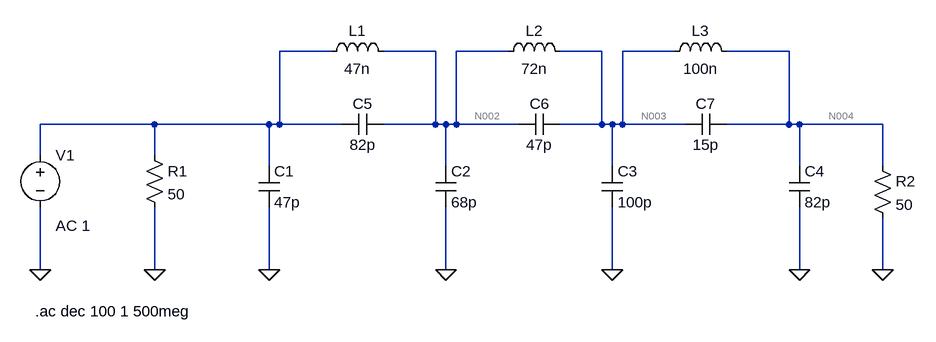
[diagram p0: schematic lpf_keyi-voltage_source.asc]
lpf_keyi-voltage_source.asc, the LTspice schematic file:
Version 4.1
SHEET 1 1396 680
WIRE 480 -16 400 -16
WIRE 640 -16 560 -16
WIRE 752 -16 672 -16
WIRE 896 -16 832 -16
WIRE 1008 -16 928 -16
WIRE 1184 -16 1088 -16
WIRE 208 96 32 96
WIRE 384 96 208 96
WIRE 400 96 400 -16
WIRE 400 96 384 96
WIRE 496 96 400 96
WIRE 640 96 640 -16
WIRE 640 96 560 96
WIRE 656 96 640 96
WIRE 672 96 672 -16
WIRE 672 96 656 96
WIRE 768 96 672 96
WIRE 896 96 896 -16
WIRE 896 96 832 96
WIRE 912 96 896 96
WIRE 928 96 928 -16
WIRE 928 96 912 96
WIRE 1024 96 928 96
WIRE 1184 96 1184 -16
WIRE 1184 96 1088 96
WIRE 1200 96 1184 96
WIRE 1328 96 1200 96
WIRE 32 144 32 96
WIRE 208 144 208 96
WIRE 384 160 384 96
WIRE 656 160 656 96
WIRE 912 160 912 96
WIRE 1200 160 1200 96
WIRE 1328 160 1328 96
WIRE 32 320 32 224
WIRE 208 320 208 224
WIRE 384 320 384 224
WIRE 656 320 656 224
WIRE 912 320 912 224
WIRE 1200 320 1200 224
WIRE 1328 320 1328 240
FLAG 32 320 0
FLAG 208 320 0
FLAG 384 320 0
FLAG 656 320 0
FLAG 912 320 0
FLAG 1200 320 0
FLAG 1328 320 0
SYMBOL res 192 128 R0
SYMATTR InstName R1
SYMATTR Value 50
SYMBOL cap 368 160 R0
SYMATTR InstName C1
SYMATTR Value 47p
SYMBOL cap 640 160 R0
SYMATTR InstName C2
SYMATTR Value 68p
SYMBOL cap 896 160 R0
SYMATTR InstName C3
SYMATTR Value 100p
SYMBOL res 1312 144 R0
SYMATTR InstName R2
SYMATTR Value 50
SYMBOL cap 1184 160 R0
SYMATTR InstName C4
SYMATTR Value 82p
SYMBOL cap 560 80 R90
WINDOW 0 0 32 VBottom 2
WINDOW 3 32 32 VTop 2
SYMATTR InstName C5
SYMATTR Value 82p
SYMBOL cap 832 80 R90
WINDOW 0 0 32 VBottom 2
WINDOW 3 32 32 VTop 2
SYMATTR InstName C6
SYMATTR Value 47p
SYMBOL cap 1088 80 R90
WINDOW 0 0 32 VBottom 2
WINDOW 3 32 32 VTop 2
SYMATTR InstName C7
SYMATTR Value 15p
SYMBOL ind 464 0 R270
WINDOW 0 32 56 VTop 2
WINDOW 3 5 56 VBottom 2
SYMATTR InstName L1
SYMATTR Value 47n
SYMATTR SpiceLine Rser=1m
SYMBOL ind 736 0 R270
WINDOW 0 32 56 VTop 2
WINDOW 3 5 56 VBottom 2
SYMATTR InstName L2
SYMATTR Value 72n
SYMATTR SpiceLine Rser=1m
SYMBOL ind 992 0 R270
WINDOW 0 32 56 VTop 2
WINDOW 3 5 56 VBottom 2
SYMATTR InstName L3
SYMATTR Value 100n
SYMATTR SpiceLine Rser=1m
SYMBOL voltage 32 128 R0
WINDOW 123 24 124 Left 2
WINDOW 39 0 0 Left 0
SYMATTR InstName V1
SYMATTR Value ""
SYMATTR Value2 AC 1
TEXT 24 384 Left 2 !.ac dec 100 1 500meg

The netlist it stands for:
* lpf_keyi-voltage_source.asc
R1 N001 0 50
C1 N001 0 47p
C2 N002 0 68p
C3 N003 0 100p
R2 N004 0 50
C4 N004 0 82p
C5 N002 N001 82p
C6 N003 N002 47p
C7 N004 N003 15p
L1 N001 N002 47n Rser=1m
L2 N002 N003 72n Rser=1m
L3 N003 N004 100n Rser=1m
V1 N001 0 AC 1
.ac dec 100 1 500meg
.backanno
.end

* Results of the author's LTspice run, read from the files saved beside the schematic
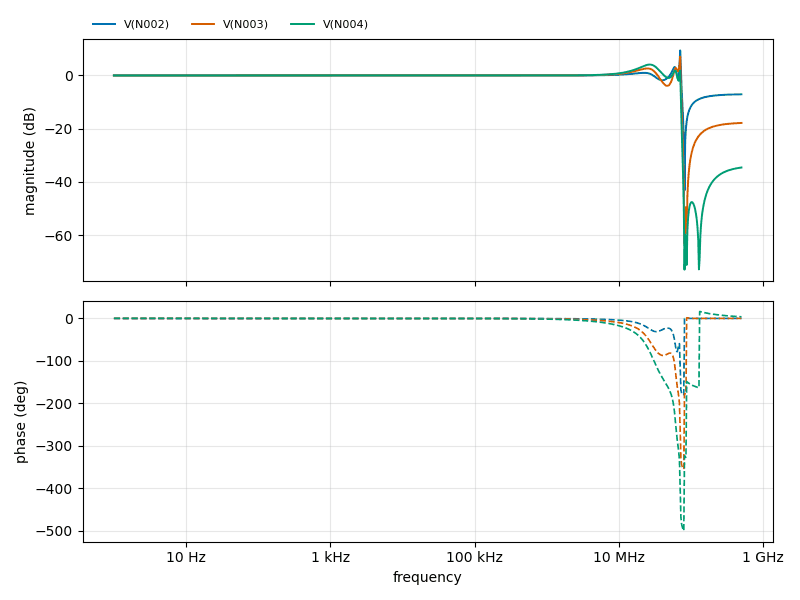
[diagram p1: AC Analysis of lpf_keyi-voltage_source.asc, plotted from the saved traces]
* AC Analysis, 1 run:
*   V(N002): -0.00 dB at 1 Hz, -7.07 dB at 500 MHz, peak 9.42 dB at 70.79 MHz, 3 dB below the peak at 69.95 MHz and 71.43 MHz
*   V(N003): -0.00 dB at 1 Hz, -17.84 dB at 500 MHz, peak 7.07 dB at 70.79 MHz, 3 dB below the peak at 69.25 MHz and 71.26 MHz
*   V(N004): -0.00 dB at 1 Hz, -34.59 dB at 500 MHz, peak 4.11 dB at 26.92 MHz, 3 dB below the peak at 11.66 MHz and 38.61 MHz